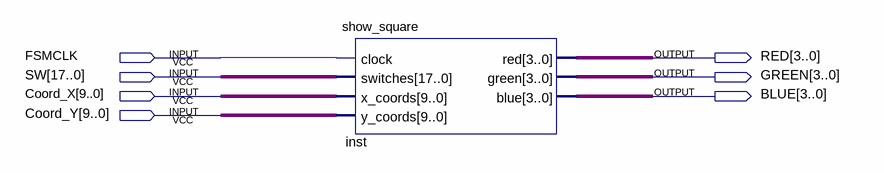
[diagram p0: schematic sheet]
// Quartus schematic video_generator.bdf as structural Verilog: 1 symbols, 7 pins
module video_generator (
  input  FSMCLK,
  input  [17:0] SW,
  input  [9:0] Coord_X,
  input  [9:0] Coord_Y,
  output [3:0] RED,
  output [3:0] GREEN,
  output [3:0] BLUE
);

  show_square inst (
    .clock(FSMCLK), .switches(SW), .x_coords(Coord_X), .y_coords(Coord_Y), .red(RED), .green(GREEN),
    .blue(BLUE));
endmodule
